# EAGLE schematic StepDrv (EAGLE 7.2.0)
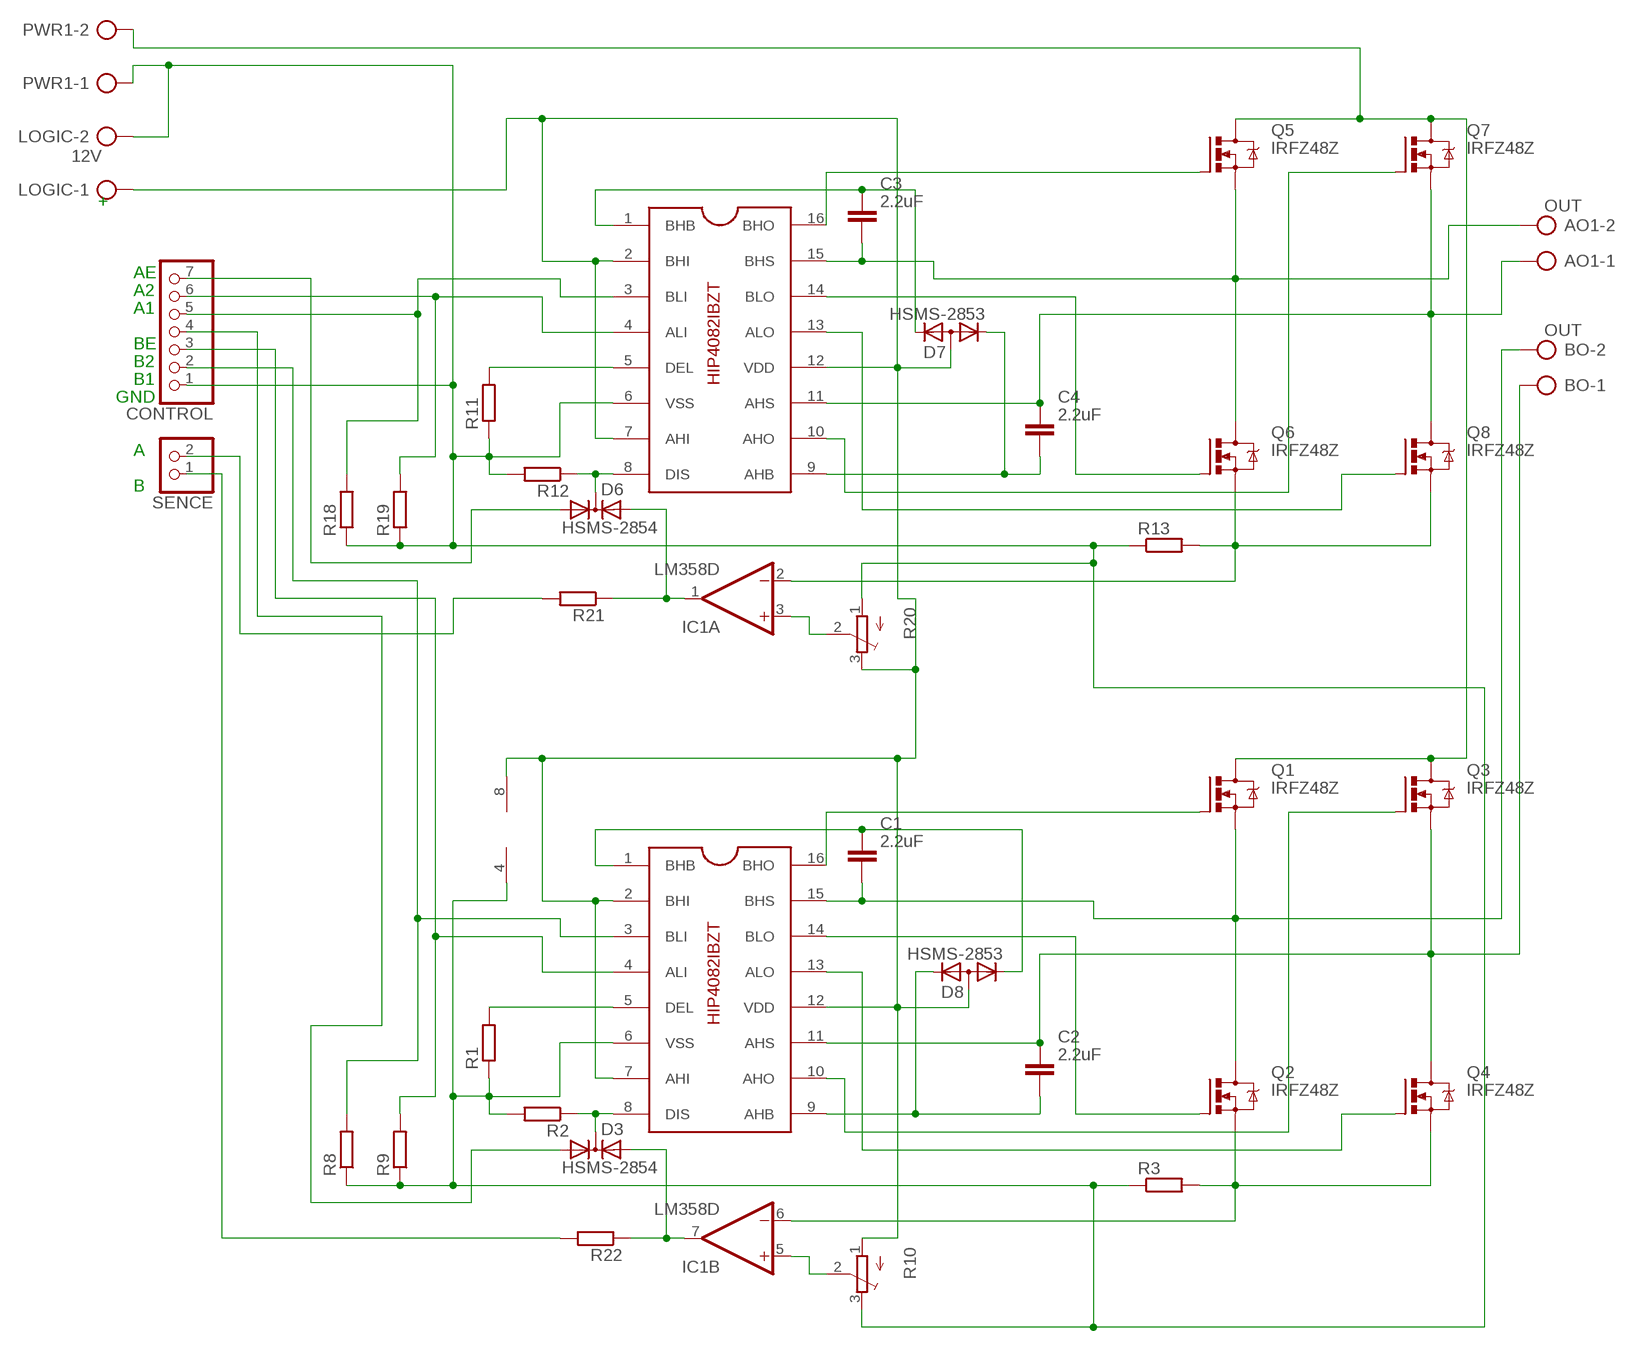
[diagram p0: schematic, sheet 1]

## Parts
AO1  OUT  AK300/2  [AK300/2]
BO  OUT  AK300/2  [AK300/2]
C1  2.2uF  CAPACITOR_NPOL-1206  [C1206]
C2  2.2uF  CAPACITOR_NPOL-1206  [C1206]
C3  2.2uF  CAPACITOR_NPOL-1206  [C1206]
C4  2.2uF  CAPACITOR_NPOL-1206  [C1206]
CONTROL  PINHD-1X7  [1X07]
D3  HSMS-2854  [SOT23]
D6  HSMS-2854  [SOT23]
D7  HSMS-2853  [SOT23]
D8  HSMS-2853  [SOT23]
IC1  LM358D  [SO08]
LOGIC  12V  AK300/2  [AK300/2]
PWR1  AK300/2  [AK300/2]
Q1  IRFZ48Z  [TO220BH]
Q2  IRFZ48Z  [TO220BH]
Q3  IRFZ48Z  [TO220BH]
Q4  IRFZ48Z  [TO220BH]
Q5  IRFZ48Z  [TO220BH]
Q6  IRFZ48Z  [TO220BH]
Q7  IRFZ48Z  [TO220BH]
Q8  IRFZ48Z  [TO220BH]
R1  R-EU_R1206  [R1206]
R2  R-EU_R1206  [R1206]
R3  R-EU_0922/22  [0922/22]
R8  R-EU_M1206  [M1206]
R9  R-EU_M1206  [M1206]
R10  TRIM_EU-3223G  [3223G]
R11  R-EU_R1206  [R1206]
R12  R-EU_R1206  [R1206]
R13  R-EU_0922/22  [0922/22]
R18  R-EU_M1206  [M1206]
R19  R-EU_M1206  [M1206]
R20  TRIM_EU-3223G  [3223G]
R21  R-EU_M1206  [M1206]
R22  R-EU_M1206  [M1206]
SENCE  PINHD-1X2  [1X02]
U$1  HIP4082IBZT  [SO16]
U$2  HIP4082IBZT  [SO16]

## Nets
N$1: C2.2 D8.2(K2) U$1.9(AHB)
N$2: D3.3(C) R2.1 U$1.8(DIS)
N$3: C1.1 D8.1(K1) U$1.1(BHB)
N$4: BO.2 C1.2 Q1.S Q2.D U$1.15(BHS)
N$5: CONTROL.4 D3.1(A1)
N$6: R1.2 U$1.5(DEL)
N$7: R21.2 SENCE.2
N$8: BO.1 C2.1 Q3.S Q4.D U$1.11(AHS)
N$9: CONTROL.3 R9.2 U$1.4(ALI)
N$10: CONTROL.2 R8.2 U$1.3(BLI)
N$11: IC1.6(B:-IN) Q2.S Q4.S R3.2
N$12: Q1.G U$1.16(BHO)
N$13: Q2.G U$1.14(BLO)
N$14: Q3.G U$1.10(AHO)
N$15: Q4.G U$1.13(ALO)
N$16: D3.2(A2) IC1.7(B:OUT) R22.1
N$18: IC1.5(B:+IN) R10.2(S)
N$19: C4.2 D7.1(K1) U$2.9(AHB)
N$20: C3.1 D7.2(K2) U$2.1(BHB)
N$21: AO1.2 C3.2 Q5.S Q6.D U$2.15(BHS)
N$23: CONTROL.7 D6.1(A1)
N$24: R11.2 U$2.5(DEL)
N$25: AO1.1 C4.1 Q7.S Q8.D U$2.11(AHS)
N$26: IC1.2(A:-IN) Q6.S Q8.S R13.2
N$27: Q5.G U$2.16(BHO)
N$28: Q6.G U$2.14(BLO)
N$29: Q7.G U$2.10(AHO)
N$30: Q8.G U$2.13(ALO)
N$31: CONTROL.6 R19.2 U$2.4(ALI)
N$32: CONTROL.5 R18.2 U$2.3(BLI)
N$33: R22.2 SENCE.1
N$34: D6.3(C) R12.1 U$2.8(DIS)
N$35: D6.2(A2) IC1.1(A:OUT) R21.1
N$36: IC1.3(A:+IN) R20.2(S)
N$37: PWR1.2 Q1.D Q3.D Q5.D Q7.D
N$38: CONTROL.1 IC1.4(P:V-) LOGIC.2 PWR1.1 R1.1 R2.2 R3.1 R8.1 R9.1 R10.3(E) R11.1 R12.2 R13.1 R18.1 R19.1 R20.1(A) U$1.6(VSS) U$2.6(VSS)
N$39: D7.3(A) D8.3(A) IC1.8(P:V+) LOGIC.1 R10.1(A) R20.3(E) U$1.2(BHI) U$1.7(AHI) U$1.12(VDD) U$2.2(BHI) U$2.7(AHI) U$2.12(VDD)

## Notes on the sheet
- +
- AE
- A2
- A1
- BE
- B2
- B1
- GND
- A
- B

## Library data of the parts
AO1 BO LOGIC PWR1 = con-ptr500:AK300/2: CONNECTOR; OC_FARNELL: unknown; OC_NEWARK: unknown
C1-C4 = dp_devices:CAPACITOR_NPOL: Non-Polarized capacitor in various packages
CONTROL = pinhead:PINHD-1X7: PIN HEADER
D3 D6 = avago:HSMS-2854: Surface Mount Microwave Schottky Detector Diodes Source: Data sheet <http://www.farnell.com/datasheets/461166.pdf>
D7 D8 = avago:HSMS-2853: Surface Mount Microwave Schottky Detector Diodes Source: Data sheet <http://www.farnell.com/datasheets/461166.pdf>
IC1 = linear:LM358: OP AMP also LM158; LM258; LM2904 Source: http://cache.national.com/ds/LM/LM158.pdf
Q1-Q8 = transistor-power:IRFZ48: N Channel HEXFET® Power MOSFET Logic Level Source: http://www.irf.com/product-info/datasheets/data/irfz48z.pdf
R1-R3 R8 R9 R11-R13 R18 R19 R21 R22 = rcl:R-EU_: RESISTOR, European symbol
R10 R20 = pot:TRIM_EU-: POTENTIOMETER
SENCE = pinhead:PINHD-1X2: PIN HEADER
U$1 U$2 = mosfet_drivers:HIP4082IBZT: HIP4082IBZT Тип драйвера сдвоенный драйвер полумоста Время задержки, нс 75 Диапазон рабочих напряжений, В 10…20 Диапазон рабочих температур, С -55…+125 Тип входа неинвертирующий Количество нижних каналов 2 Количество верхних каналов 2 Максимальное напряжение смещения, В 95 Максимальный выходной ток нарастания/спада 1.4/1.4 Корпус so16